# Altium schematic sheet Controller.SchDoc
size A2
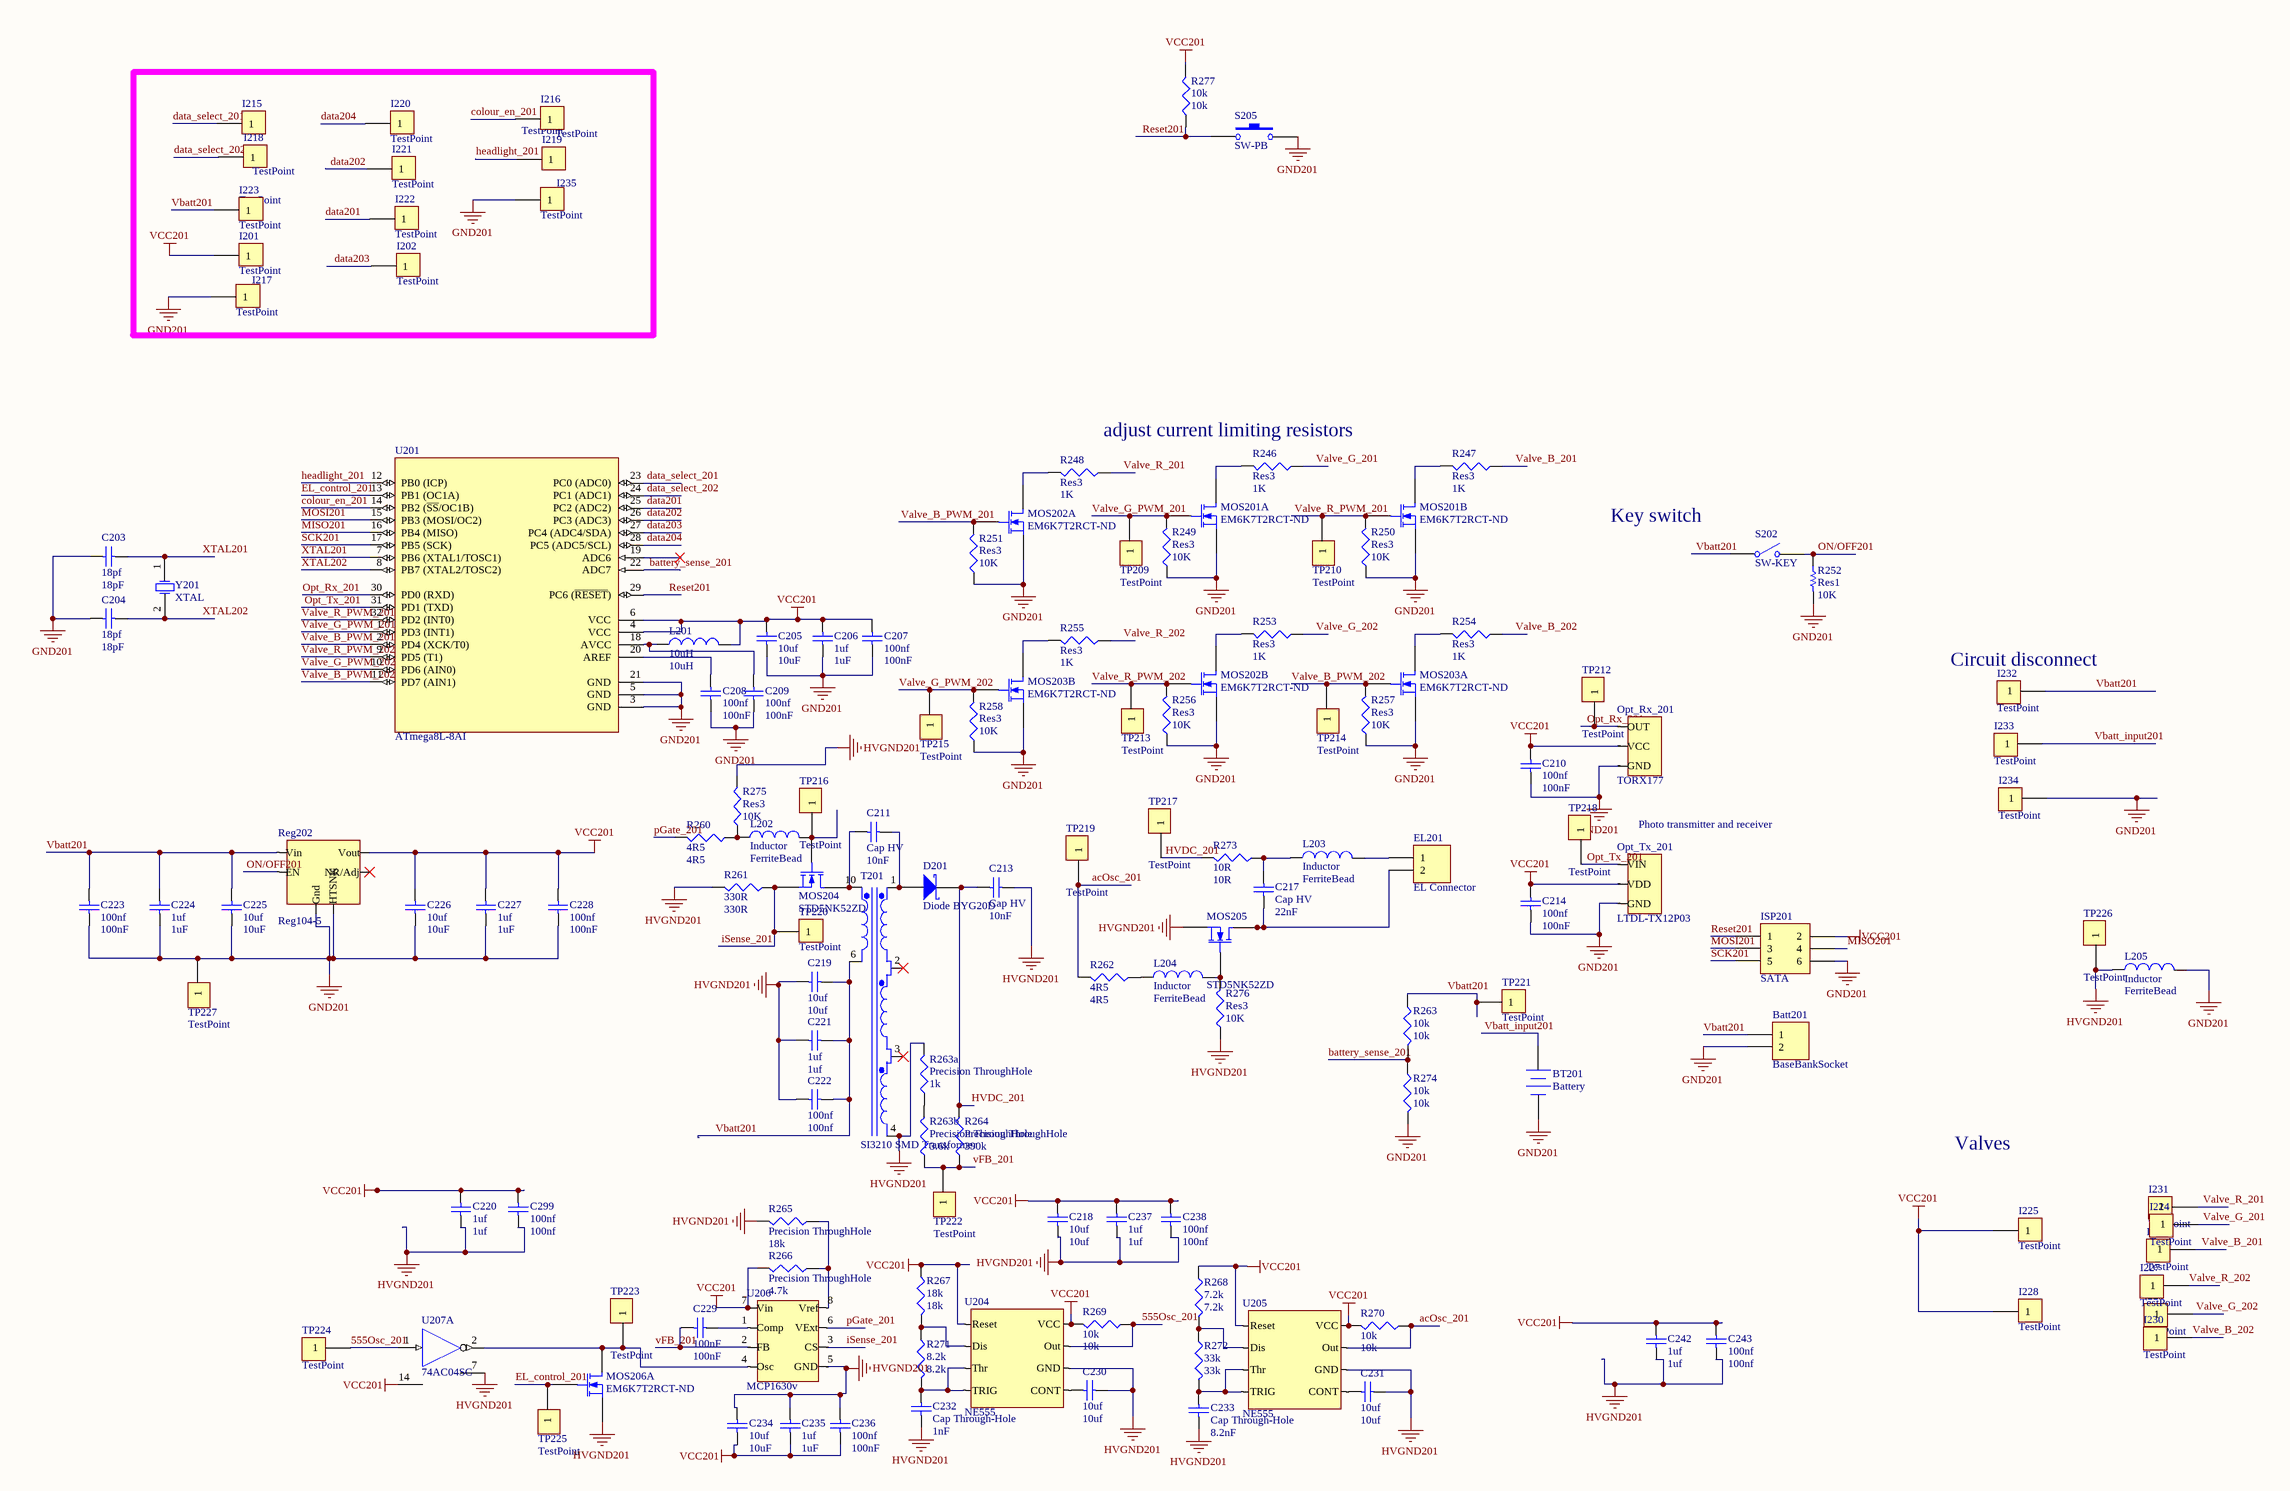
[diagram p0: Controller.SchDoc]

## Parts
Batt201  BaseBankSocket  [HDR1X2]
BT201  Battery  [BAT-2]
C203  18pf  [0603]
C204  18pf  [0603]
C205  10uf  [0805]
C206  1uf  [0603]
C207  100nf  [0603]
C208  100nf  [0603]
C209  100nf  [0603]
C210  100nf  [0603]
C211  Cap HV  value 10nF  [10n MU Capacitor (HV)]
C213  Cap HV  value 10nF  [10n MU Capacitor (HV)]
C214  100nf  [0603]
C217  Cap HV  value 22nF  [22N MU Capacitor (HV)]
C218  10uf  [0805]
C219  10uf  [0805]
C220  1uf  [0603]
C221  1uf  [0603]
C222  100nf  [0603]
C223  100nf  [0603]
C224  1uf  [0603]
C225  10uf  [0805]
C226  10uf  [0805]
C227  1uf  [0603]
C228  100nf  [0603]
C229  100nF  [0603]
C230  10uf  [0805]
C231  10uf  [0805]
C232  Cap Through-Hole  value 1nF  [Axial 0.4 MU]
C233  Cap Through-Hole  value 8.2nF  [Axial 0.4 MU]
C234  10uf  [0805]
C235  1uf  [0603]
C236  100nf  [0603]
C237  1uf  [0603]
C238  100nf  [0603]
C242  1uf  [0603]
C243  100nf  [0603]
C299  100nf  [0603]
D201  Diode BYG20D  [BYG20J-E3]
EL201  EL Connector  [HV connector]
I201  TestPoint  [TestPoint]
I202  TestPoint  [TestPoint]
I215  TestPoint  [TestPoint]
I216  TestPoint  [TestPoint]
I217  TestPoint  [TestPoint]
I218  TestPoint  [TestPoint]
I219  TestPoint  [TestPoint]
I220  TestPoint  [TestPoint]
I221  TestPoint  [TestPoint]
I222  TestPoint  [TestPoint]
I223  TestPoint  [TestPoint]
I224  TestPoint  [TestPoint]
I225  TestPoint  [TestPoint]
I226  TestPoint  [TestPoint]
I227  TestPoint  [TestPoint]
I228  TestPoint  [TestPoint]
I229  TestPoint  [TestPoint]
I230  TestPoint  [TestPoint]
I231  TestPoint  [TestPoint]
I232  TestPoint  [TestPoint]
I233  TestPoint  [TestPoint]
I234  TestPoint  [TestPoint]
I235  TestPoint  [TestPoint]
ISP201  SATA  [SATA]
L201  10uH  [0805]
L202  Inductor  value FerriteBead  [Axial 0.4 MU]
L203  Inductor  value FerriteBead  [Axial 0.4 MU]
L204  Inductor  value FerriteBead  [Axial 0.4 MU]
L205  Inductor  value FerriteBead  [Axial 0.4 MU]
MOS201  EM6K7T2RCT-ND  [EM6K7T2R-EMT6]  (parts A,B of 2)
MOS202  EM6K7T2RCT-ND  [EM6K7T2R-EMT6]  (parts A,B of 2)
MOS203  EM6K7T2RCT-ND  [EM6K7T2R-EMT6]  (parts A,B of 2)
MOS204  STD5NK52ZD  [DPAK]
MOS205  STD5NK52ZD  [DPAK]
MOS206  EM6K7T2RCT-ND  [EM6K7T2R-EMT6]  (part A of 2)
Opt_Rx_201  TORX177  [Optical RX]
Opt_Tx_201  LTDL-TX12P03  [Optical TX]
R246  Res3  value 1K  [0805]
R247  Res3  value 1K  [0805]
R248  Res3  value 1K  [0805]
R249  Res3  value 10K  [0805]
R250  Res3  value 10K  [0805]
R251  Res3  value 10K  [0805]
R252  Res1  value 10K  [0805]
R253  Res3  value 1K  [0805]
R254  Res3  value 1K  [0805]
R255  Res3  value 1K  [0805]
R256  Res3  value 10K  [0805]
R257  Res3  value 10K  [0805]
R258  Res3  value 10K  [0805]
R260  4R5  [0805]
R261  330R  [0805]
R262  4R5  [0805]
R263  10k  [0603]
R263a  Precision ThroughHole  value 1k  [Axial 0.4 MU]
R263b  Precision ThroughHole  value 3.6k  [Axial 0.4 MU]
R264  Precision ThroughHole  value 390k  [Axial 0.4 MU]
R265  Precision ThroughHole  value 18k  [Axial 0.4 MU]
R266  Precision ThroughHole  value 4.7k  [Axial 0.4 MU]
R267  18k  [0603]
R268  7.2k  [0805]
R269  10k  [0603]
R270  10k  [0603]
R271  8.2k  [0805]
R272  33k  [0805]
R273  10R  [0805]
R274  10k  [0603]
R275  Res3  value 10K  [0805]
R276  Res3  value 10K  [0805]
R277  10k  [0603]
Reg202  Reg104-5  [REG104-5-DDPAK5]
S202  SW-KEY  [2 pin switch (surface mount)]
S205  SW-PB  [2 pin switch (surface mount)]
T201  SI3210 SMD Transformer  [SI3210 SMD Transformer]
TP209  TestPoint  [TestPoint]
TP210  TestPoint  [TestPoint]
TP212  TestPoint  [TestPoint]
TP213  TestPoint  [TestPoint]
TP214  TestPoint  [TestPoint]
TP215  TestPoint  [TestPoint]
TP216  TestPoint  [TestPoint]
TP217  TestPoint  [TestPoint]
TP218  TestPoint  [TestPoint]
TP219  TestPoint  [TestPoint]
TP220  TestPoint  [TestPoint]
TP221  TestPoint  [TestPoint]
TP222  TestPoint  [TestPoint]
TP223  TestPoint  [TestPoint]
TP224  TestPoint  [TestPoint]
TP225  TestPoint  [TestPoint]
TP226  TestPoint  [TestPoint]
TP227  TestPoint  [TestPoint]
U201  ATmega8L-8AI  [ATMega_GOOD]
U204  NE555  [NE555]
U205  NE555  [NE555]
U206  MCP1630v  [8MSOP (MCP Alternative)]
U207  74AC04SC  [74AC04SC 14-SOIC]  (part A of 6)
Y201  XTAL  [ABLS-16MHz-B4-T]

## Nets
GND: C213.1 C218.2 C219.2 C220.2 C221.2 C222.2 C230.1 C231.1 C232.1 C233.1 C234.2 C235.2 C236.2 C237.2 C238.2 C242.2 C243.2 C299.2 L205.1 MOS205.3(S) MOS206.1(S) R261.2 R263a.2 R265.2 R275.2 R276.1 T201.4(Sec3-) TP226.1 U204.1(GND) U205.1(GND) U206.5(GND) U207.7(GND)  [also labelled HVGND201]
GND201: Batt201.2 BT201.2(-) C203.1 C204.1 C205.1 C206.1 C207.1 C208.1 C209.1 C210.1 C214.1 C223.1 C224.1 C225.1 C226.1 C227.1 C228.1 I217.1 I234.1 I235.1 ISP201.6 L205.2 MOS201.1(S) MOS201.4(S) MOS202.1(S) MOS202.4(S) MOS203.1(S) MOS203.4(S) Opt_Rx_201.2(GND) Opt_Tx_201.3(GND) R249.1 R250.1 R251.1 R252.2 R256.1 R257.1 R258.1 R274.2 Reg202.3(Gnd) Reg202.6(HTSNK) S205.2 TP227.1 U201.3(GND) U201.5(GND) U201.21(GND)
VCC: C205.2 C206.2 C207.2 C210.2 C214.2 C218.1 C220.1 C226.2 C227.2 C228.2 C234.1 C235.1 C236.1 C237.1 C238.1 C242.1 C243.1 C299.1 I201.1 I225.1 I228.1 ISP201.2 L201.2 Opt_Rx_201.3(VCC) Opt_Tx_201.2(VDD) R266.2 R267.1 R268.1 R269.2 R270.2 R277.2 Reg202.2(Vout) U201.4(VCC) U201.6(VCC) U204.4(Reset) U204.8(VCC) U205.4(Reset) U205.8(VCC) U206.7(Vin) U207.14(VCC)  [also labelled VCC201]
555Osc_201: R269.1 TP224.1 U204.3(Out) U207.1(A)
acOsc_201: R262.2 R270.1 TP219.1 U205.3(Out)
battery_sense_201: R263.2 R274.1 U201.22(ADC7)
colour_en_201: I216.1 U201.14(PB2_(~{SS}/OC1B))
data201: I222.1 U201.25(PC2_(ADC2))
data202: I221.1 U201.26(PC3_(ADC3))
data203: I202.1 U201.27(PC4_(ADC4/SDA))
data204: I220.1 U201.28(PC5_(ADC5/SCL))
data_select_201: I215.1 U201.23(PC0_(ADC0))
data_select_202: I218.1 U201.24(PC1_(ADC1))
EL_control_201: MOS206.2(G) TP225.1 U201.13(PB1_(OC1A))
headlight_201: I219.1 U201.12(PB0_(ICP))
HVDC_201: C213.2 D201.1(K) R264.2 R273.1 TP217.1
iSense_201: MOS204.3(S) R261.1 TP220.1 U206.3(CS)
MISO201: ISP201.4 U201.16(PB4_(MISO))
MOSI201: ISP201.3 U201.15(PB3_(MOSI/OC2))
ON/OFF201: R252.1 Reg202.5(EN) S202.2(NO)
Opt_Rx_201: Opt_Rx_201.1(OUT) TP212.1 U201.30(PD0_(RXD))
Opt_Tx_201: Opt_Tx_201.1(VIN) TP218.1 U201.31(PD1_(TXD))
pGate_201: R260.2 U206.6(VExt)
Reset201: ISP201.1 R277.1 S205.1 U201.29(PC6_(~{RESET}))
SCK201: ISP201.5 U201.17(PB5_(SCK))
Valve_B_201: I226.1 R247.1
Valve_B_202: I230.1 R254.1
Valve_B_PWM_201: MOS202.2(G) R251.2 U201.2(PD4_(XCK/T0))
Valve_B_PWM_202: MOS203.2(G) R257.2 TP214.1 U201.11(PD7_(AIN1))
Valve_G_201: I224.1 R246.1
Valve_G_202: I229.1 R253.1
Valve_G_PWM_201: MOS201.2(G) R249.2 TP209.1 U201.1(PD3_(INT1))
Valve_G_PWM_202: MOS203.5(G) R258.2 TP215.1 U201.10(PD6_(AIN0))
Valve_R_201: I231.1 R248.1
Valve_R_202: I227.1 R255.1
Valve_R_PWM_201: MOS201.5(G) R250.2 TP210.1 U201.32(PD2_(INT0))
Valve_R_PWM_202: MOS202.5(G) R256.2 TP213.1 U201.9(PD5_(T1))
Vbatt201: Batt201.1 C219.1 C221.1 C222.1 C223.2 C224.2 C225.2 I223.1 I232.1 R263.1 Reg202.1(Vin) S202.1(COMMON) T201.6(Pri-) TP221.1
Vbatt_input201: BT201.1(+) I233.1
vFB_201: C229.2 R263b.1 R264.1 TP222.1 U206.2(FB)
XTAL201: C203.2 U201.7(PB6_(XTAL1/TOSC1)) Y201.1(OSC1)
XTAL202: C204.2 U201.8(PB7_(XTAL2/TOSC2)) Y201.2(OSC2)
NetC208_2: C208.2 U201.20(AREF)
NetC209_2: C209.2 L201.1 U201.18(AVCC)
NetC211_1: C211.1 D201.3(A) T201.1(Sec1+)
NetC211_2: C211.2 MOS204.1(D) T201.10(Pri+)
NetC217_1: C217.1 EL201.2 MOS205.1(D)
NetC217_2: C217.2 L203.1 R273.2
NetC229_1: C229.1 U206.1(Comp)
NetC230_2: C230.2 U204.5(CONT)
NetC231_2: C231.2 U205.5(CONT)
NetC232_2: C232.2 R271.2 U204.2(TRIG) U204.6(Thr)
NetC233_2: C233.2 R272.2 U205.2(TRIG) U205.6(Thr)
NetEL201_1: EL201.1 L203.2
NetL202_1: L202.1 R260.1 R275.1
NetL202_2: L202.2 MOS204.2(G) TP216.1
NetL204_1: L204.1 R262.1
NetL204_2: L204.2 MOS205.2(G) R276.2
NetMOS201_3: MOS201.3(D) R247.2
NetMOS201_6: MOS201.6(D) R246.2
NetMOS202_3: MOS202.3(D) R253.2
NetMOS202_6: MOS202.6(D) R248.2
NetMOS203_3: MOS203.3(D) R255.2
NetMOS203_6: MOS203.6(D) R254.2
NetMOS206_6: MOS206.6(D) TP223.1 U206.4(Osc) U207.2(Y)
NetR263a_1: R263a.1 R263b.2
NetR265_1: R265.1 R266.1 U206.8(Vref)
NetR267_2: R267.2 R271.1 U204.7(Dis)
NetR268_2: R268.2 R272.1 U205.7(Dis)

Not connected (* = marked no-connect by the designer): Reg202 4(NR/Adj)*; T201 2(Sec2+)* 3(Sec3+)*; U201 19(ADC6)*

## Notes on the sheet
- adjust current limiting resistors
- Key switch
- (near I232) Circuit disconnect
- Photo transmitter and receiver
- Valves

## Library data of the parts
Batt201 EL201 = Header 2: Header, 2-Pin; LatestRevisionDate: 17-Jul-2002; LatestRevisionNote: Re-released for DXP Platform.; Publisher: Altium Limited
BT201 = Battery: Multicell Battery; Published: 24-Mar-1999; LatestRevisionDate: 17-Jul-2002; LatestRevisionNote: Re-released for DXP Platform.; PackageReference: BAT-2; Publisher: Altium Limited
C203-C211 C213 C214 C217-C238 C242 C243 C299 = Cap Semi: Capacitor (Semiconductor SIM Model); Published: 8-Jun-2000; LatestRevisionDate: 29-May-2009; LatestRevisionNote: IPC-7351 Footprint Added.; PackageReference: C1206; Publisher: Altium Limited; PackageDescription: Chip Capacitor
  C203 C204: Value: 18pF
  C205 C225 C226 C234: Value: 10uF
  C206 C224 C227 C235: Value: 1uF
  C207-C210 C214 C223 C228 C229 C236: Value: 100nF
  C218 C219 C230 C231: Value: 10uf
  C220 C221 C237 C242: Value: 1uf
  C222 C238 C243 C299: Value: 100nf
D201 = Diode 10TQ035: Schottky Rectifier; Note: Terminal 2 is the TAB and is electrically connected to the cathode; Published: 8-Jun-2000; LatestRevisionDate: 17-Jul-2002; LatestRevisionNote: Re-released for DXP Platform.; DatasheetVersion: PD-2.057B; PackageVersion: Feb-1998; PackageReference: TO-220AC; Publisher: Altium Limited; ComponentLink1Description: Manufacturer Link; ComponentLink1URL: http://www.irf.com/; ComponentLink2Description: Datasheet; ComponentLink2URL: http://www.irf.com/product-info/datasheets/data/10tq.pdf
ISP201 = Header 3X2: Header, 3-Pin, Dual row; LatestRevisionDate: 17-Jul-2002; LatestRevisionNote: Re-released for DXP Platform.; Publisher: Altium Limited
L201-L205 = Inductor: Code_IEC: 1005; Published: 8-Jun-2000; LatestRevisionDate: 29-May-2009; LatestRevisionNote: IPC-7351 Footprint Added.; PackageReference: 0402-A; Publisher: Altium Limited; PackageDescription: Chip Inductor; Code_JEITA: 0402
  L201: Value: 10uH
MOS204 MOS205 = MOSFET-N: N-Channel MOSFET; Published: 8-Jun-2000; LatestRevisionDate: 17-Jul-2002; LatestRevisionNote: Re-released for DXP Platform.; PackageVersion: 1995/1996; PackageReference: E3; Publisher: Altium Limited
Opt_Rx_201 = TORX177: Optical receiver module
Opt_Tx_201 = LTDL-TX12P03: Optical transmitter
R246-R251 R253-R258 R260-R263 R263a R263b R264-R277 = Res3: Resistor; Published: 8-Jun-2000; LatestRevisionDate: 29-May-2009; LatestRevisionNote: IPC-7351 Footprint Added.; PackageReference: J1-0603; Publisher: Altium Limited; PackageDescription: Chip Resistor
  R260 R262: Value: 4R5
  R261: Value: 330R
  R263 R269 R270 R274 R277: Value: 10k
  R267: Value: 18k
  R268: Value: 7.2k
  R271: Value: 8.2k
  R272: Value: 33k
  R273: Value: 10R
R252 = Res1: Resistor; Published: 8-Jun-2000; LatestRevisionDate: 17-Jul-2002; LatestRevisionNote: Re-released for DXP Platform.; PackageReference: AXIAL-0.3; Publisher: Altium Limited
S202 = SW-SPST: Single-Pole, Single-Throw Switch; Published: 24-Mar-1999; LatestRevisionDate: 17-Jul-2002; LatestRevisionNote: Re-released for DXP Platform.; PackageReference: SPST-2; Publisher: Altium Limited
S205 = SW-PB: Switch; Published: 24-Mar-1999; LatestRevisionDate: 17-Jul-2002; LatestRevisionNote: Re-released for DXP Platform.; PackageReference: SPST-2; Publisher: Altium Limited
U201 = ATmega8L-8AI: 8-Bit AVR Microcontroller with 8K Bytes of In-System Programmable Flash Memory; Published: 17-Sep-2003; LatestRevisionDate: 13-Apr-2006; LatestRevisionNote: IPC-7351 Footprint Added.; DatasheetVersion: 2486H-AVR-09/02; PackageVersion: revB, Oct-2001; PackageReference: 32A; Publisher: Altium Limited; PackageDescription: 32-Pin Thin Quad Flat Pack 0.8 mm Pitch; Code_JEDEC: MS-026-ABA; ComponentLink1Description: Manufacturer Link; ComponentLink1URL: http://www.atmel.com; ComponentLink2Description: Datasheet; ComponentLink2URL: http://www.atmel.com/dyn/resources/prod_documents/doc2486.pdf
U207 = SN54HC04J: Hex Inverter; Published: 8-Jun-2000; LatestRevisionDate: 04-Mar-2005; LatestRevisionNote: Stylized 3D Model Added.; DatasheetVersion: May-1997; PackageVersion: Jun-1999; PackageReference: J014; Publisher: Altium Limited; PackageDescription: DIP; 14 Leads; Row Spacing 7.62 mm; Pitch 2.54 mm; ComponentLink1Description: Manufacturer Link; ComponentLink1URL: http://www.ti.com/; ComponentLink2Description: Datasheet; ComponentLink2URL: http://www-s.ti.com/sc/ds/sn54hc04.pdf; ComponentLink3Description: Packaging Specification; ComponentLink3URL: http://focus.ti.com/lit/ml/mcer002d/mcer002d.pdf
Y201 = XTAL: Crystal Oscillator; Published: 8-Jun-2000; LatestRevisionDate: 17-Jul-2002; LatestRevisionNote: Re-released for DXP Platform.; PackageReference: R38; Publisher: Altium Limited
MOS201-MOS203 MOS206 = EM6K7T2RCT-ND: Supplier 1: Digi-Key